# EAGLE design BiPAP_PCB_V2_Released (EAGLE 9.6.2)
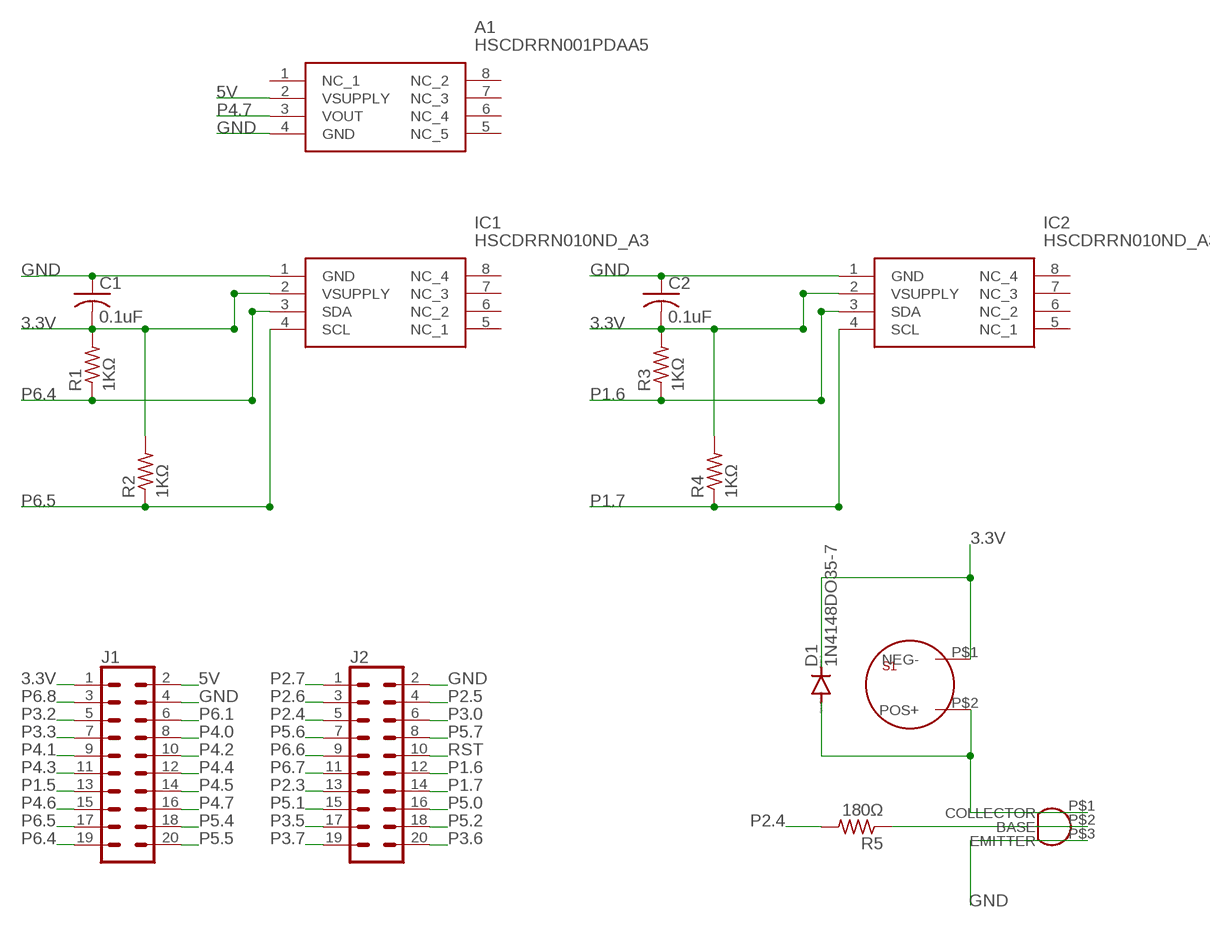
[diagram p0: schematic, sheet 1]

## Parts
A1  HSCDRRN001PDAA5  [HSCDRRN001PDAA5]
C1  0.1uF  C-USC0805  [C0805]
C2  0.1uF  C-USC0805  [C0805]
D1  1N4148DO35-7  [DO35-7]
IC1  HSCDRRN010ND_A3  HSCDRRN010ND2A3  [HSCDRRN010ND2A3]
IC2  HSCDRRN010ND_A3  HSCDRRN010ND2A3  [HSCDRRN010ND2A3]
J1  CONN_10X2  [2X10]
J2  CONN_10X2  [2X10]
R1  1KΩ  R-US_R0805  [R0805]
R2  1KΩ  R-US_R0805  [R0805]
R3  1KΩ  R-US_R0805  [R0805]
R4  1KΩ  R-US_R0805  [R0805]
R5  180Ω  R-US_R0805  [R0805]
S1  CEET120B085  [CEET120B085]
T1  BC337  [BC337]

## Nets
3.3V [Power]: C1.2 C2.2 D1.C IC1.2(VSUPPLY) IC2.2(VSUPPLY) J1.1 R1.2 R2.2 R3.2 R4.2 S1.P$1(NEG-)
5V [Power]: A1.2(VSUPPLY) J1.2
GND [Power]: A1.4(GND) C1.1 C2.1 IC1.1(GND) IC2.1(GND) J1.4 J2.2 T1.P$3(EMITTER)
N$2: D1.A S1.P$2(POS+) T1.P$1(COLLECTOR)
N$3: R5.1 T1.P$2(BASE)
P1.5: J1.13
P1.6: IC2.3(SDA) J2.12 R3.1
P1.7: IC2.4(SCL) J2.14 R4.1
P2.3: J2.13
P2.4: J2.5 R5.2
P2.5: J2.4
P2.6: J2.3
P2.7: J2.1
P3.0: J2.6
P3.2: J1.5
P3.3: J1.7
P3.5: J2.17
P3.6: J2.20
P3.7: J2.19
P4.0: J1.8
P4.1: J1.9
P4.2: J1.10
P4.3: J1.11
P4.4: J1.12
P4.5: J1.14
P4.6: J1.15
P4.7: A1.3(VOUT) J1.16
P5.0: J2.16
P5.1: J2.15
P5.2: J2.18
P5.4: J1.18
P5.5: J1.20
P5.6: J2.7
P5.7: J2.8
P6.1: J1.6
P6.4: IC1.3(SDA) J1.19 R1.1
P6.5: IC1.4(SCL) J1.17 R2.1
P6.6: J2.9
P6.7: J2.11
P6.8: J1.3
RST: J2.10
Unconnected: A1.1(NC_1) A1.5(NC_5) A1.6(NC_4) A1.7(NC_3) A1.8(NC_2) IC1.5(NC_1) IC1.6(NC_2) IC1.7(NC_3) IC1.8(NC_4) IC2.5(NC_1) IC2.6(NC_2) IC2.7(NC_3) IC2.8(NC_4)

## Library data of the parts
A1 = honeywell_sensors:HSCDRRN001PDAA5: Pressure Sensor -1 psi to 1 psi Differential Medical 8-Pin DIP Module Source: Datasheet <https://www.mouser.com/ProductDetail/Honeywell/HSCDRRN001PDAA5?qs=r31gx5qWCCu%2FOWBVVx989A%3D%3D>
C1 C2 = adafruit:C-US: CAPACITOR, American symbol
D1 = diode:1N4148: DIODE high speed (Philips)
IC1 IC2 = honeywell_sensors:HSCDRRN010ND2A3: Pressure Sensor -10inH2O to 10inH2O Differential Medical 8-Pin DIP Module Source: Datasheet <https://componentsearchengine.com/Datasheets/1/HSCDRRN010ND2A3.pdf>; DESCRIPTION: Pressure Sensor -10inH2O to 10inH2O Differential Medical 8-Pin DIP Module; HEIGHT: 6.16mm; MANUFACTURER_NAME: Honeywell; MANUFACTURER_PART_NUMBER: HSCDRRN010ND2A3; MOUSER_PART_NUMBER: 785-HSCDRRN010ND2A3; MOUSER_PRICE-STOCK: https://www.mouser.com/Search/Refine.aspx?Keyword=785-HSCDRRN010ND2A3
J1 J2 = SparkFun-Connectors:CONN_10X2: Multi connection point. Often used as Generic Header-pin footprint for 0.1 inch spaced/style header connections On any of the 0.1 inch spaced packages, you can populate with these: Break Away Headers - Straight <https://www.sparkfun.com/products/116> (PRT-00116) Break Away Male Headers - Right Angle <https://www.sparkfun.com/products/553> (PRT-00553) Female Headers <https://www.sparkfun.com/products/115> (PRT-00115) Break Away Headers - Machine Pin <https://www.sparkfun.com/products/117> (PRT-00117) Break Away Female Headers - Swiss Machine Pin <https://www.sparkfun.com/products/743> (PRT-00743) Special note about the "SPECIAL" package: This was SPECIALLY designed to be used with our Graphic LCD Backpack. Be sure you want to use this! It is not only staggered on each line of header holes, but IT IS ALSO offset of the center point of the top and bottom lines by 5 mil. This causes the headers to lock into place on the "standard" footprint on the LCD screen. The extra squares on the tdocu layer are there simply to reference other pins (if you were to actually populate a longer header than ten long - this is what we do with the backpacks).
R1-R5 = adafruit:R-US_: RESISTOR, American symbol
S1 = CEE120B085:CEET120B085
T1 = BC337:BC337

## Net classes
0 default: width 0.305 mm, clearance 0.305 mm
1 Power: width 0.508 mm, clearance 0.305 mm

## Board
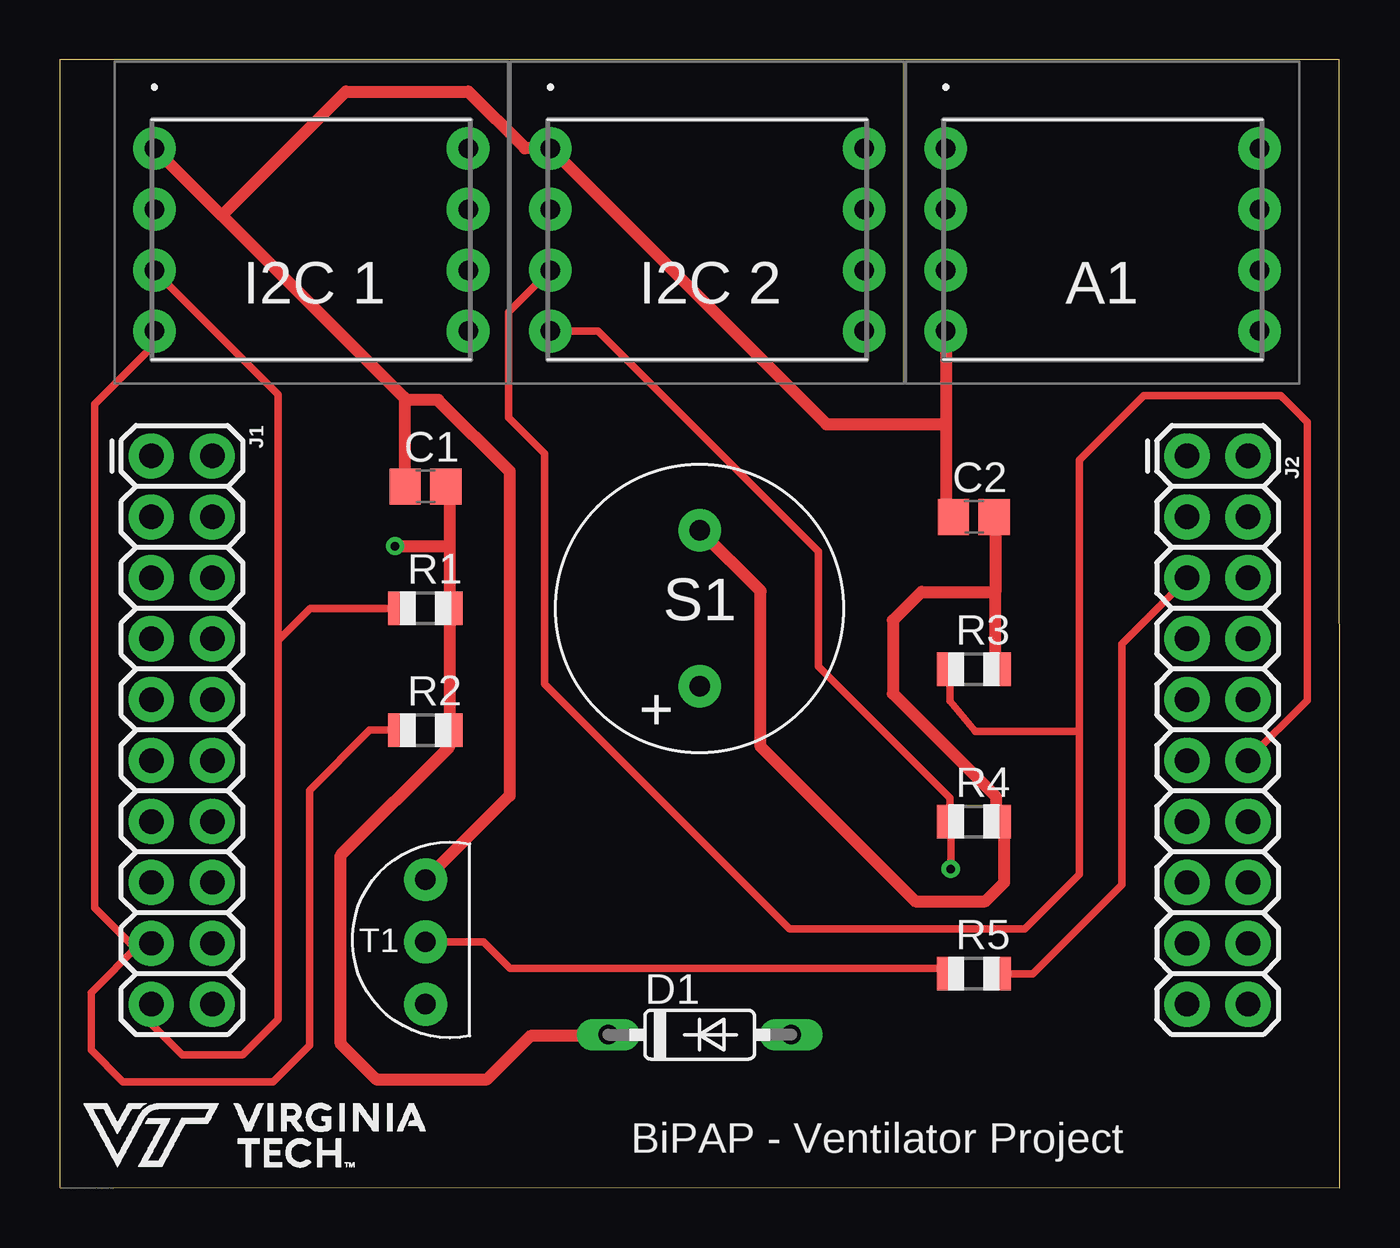
[diagram p1: board, top side]
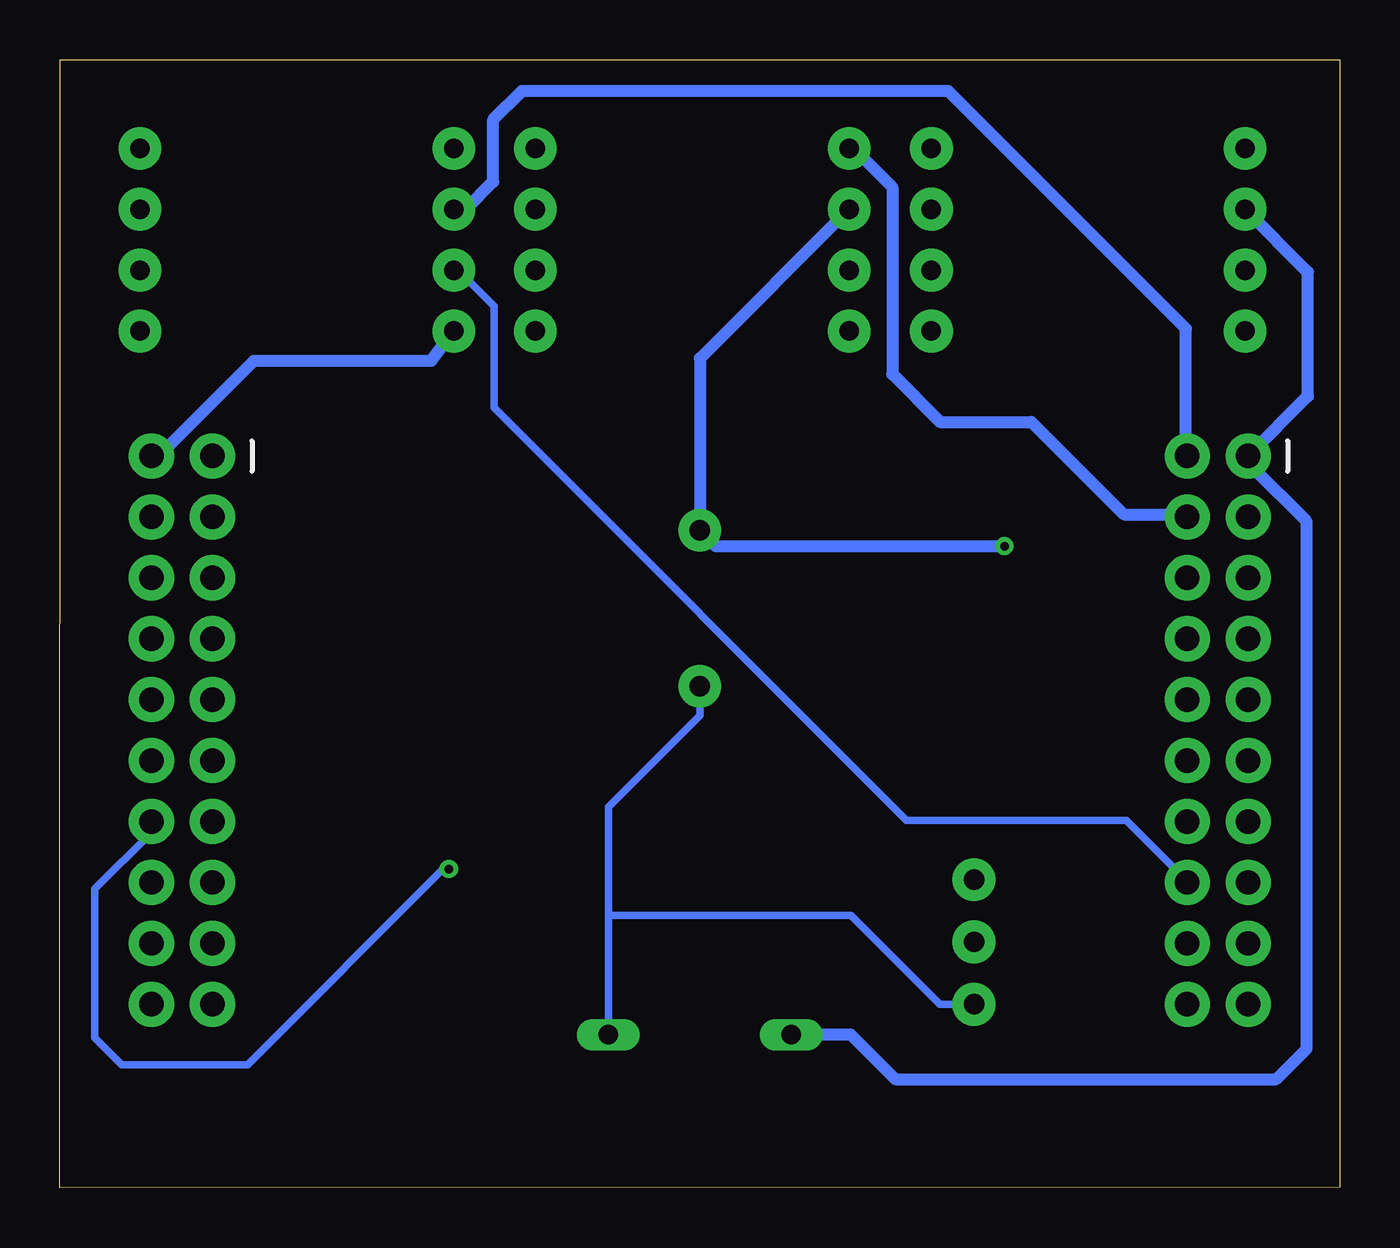
[diagram p2: board, bottom side, seen from below]

Size 53.35 x 47.02 mm. Coordinates in mm from the lower left corner, seen from the top.
Outline: 0,0.03 53.34,0 53.34,47.02 0,47.02 0,0.03
Copper layers (1*16): Top 0.035mm / dielectric 1.5mm / Bottom 0.035mm
Design rules "default": minimum track width 6mil, minimum drill 0.35mm, track to track 6mil, track to pad 6mil, pad to pad 6mil, via to via 6mil, smd to smd 6mil, copper to edge 40mil, drill to drill 6mil, minimum pad ring 10mil, minimum via ring 8mil, stop-mask expansion 4mil, vias tented up to drill 0mil, thermal gap 10mil

### Footprints (pad centres in the part's own frame; a part is rotated, then mirrored left to right if it is on the bottom)
HSCDRRN001PDAA5 = drill 0.813 pad 1.778: 1 0,0; 2 2.54,0; 3 5.08,0; 4 7.62,0; 5 7.62,13.08; 6 5.08,13.08; 7 2.54,13.08; 8 0,13.08
C0805 = smd 1.3 x 1.5: 1 -0.85,0; 2 0.85,0
DO35-7 = drill 0.813 long: A 3.81,0; C -3.81,0
HSCDRRN010ND2A3 = drill 0.813 pad 1.778: 1 0,0; 2 2.54,0; 3 5.08,0; 4 7.62,0; 5 7.62,13.08; 6 5.08,13.08; 7 2.54,13.08; 8 0,13.08
2X10 = drill 1.016 pad 1.88: 1 0,0; 2 0,2.54; 3 2.54,0; 4 2.54,2.54; 5 5.08,0; 6 5.08,2.54; 7 7.62,0; 8 7.62,2.54; 9 10.16,0; 10 10.16,2.54; 11 12.7,0; 12 12.7,2.54; 13 15.24,0; 14 15.24,2.54; 15 17.78,0; 16 17.78,2.54; 17 20.32,0; 18 20.32,2.54; 19 22.86,0; 20 22.86,2.54
R0805 = smd 1.1 x 1.4: 1 -1,0; 2 1,0
CEET120B085 = drill 0.85 pad 1.778: P$1 0,3.25; P$2 0,-3.25
BC337 = drill 0.85 pad 1.778: P$1 0,0; P$2 2.6,0; P$3 5.2,0

### Placement (x,y rotation side)
A1  36.93,43.33 270 top
C1  15.24,29.24 0 top
C2  38.1,27.97 0 top
D1  26.67,6.38 0 top
IC1  3.94,43.33 270 top
IC2  20.45,43.33 270 top
J1  3.81,30.51 270 top
J2  46.99,30.51 270 top
R1  15.24,24.16 0 top
R2  15.24,19.08 0 top
R3  38.1,21.62 0 top
R4  38.1,15.27 0 top
R5  38.1,8.92 0 top
S1  26.67,24.16 0 top
T1  15.24,7.65 90 top

### Tracks (layer width: path | path; a pad name or v marks a point on that pad's centre or on a via)
3.3V  (via drill 0.35)
  Top 0.508: R3.2 39.17,21.67 38.99,21.84 38.99,24.84 | C2.2 38.99,27.93 38.99,24.84 | R1.2 R2.2 16.24,18.4 11.71,13.87 11.71,5.99 13.21,4.5 17.78,4.5 19.61,6.32 22.81,6.32 D1.C | C1.2 16.24,29.24 R1.2 | v13.97,26.75 16.24,26.75 R1.2 | 38.99,24.84 35.92,24.84 34.72,23.65 34.72,20.6 39.01,16.31 39.01,15.27 R4.2 39.37,15 39.37,12.73 38.58,11.94 35.66,11.94 29.21,18.39 29.21,24.87 S1.P$1
  Bottom 0.508: IC1.2 1.32,38.18 1.32,32.99 J1.1 3.66,30.35 3.66,30.05 1.37,27.76 1.37,5.79 2.64,4.52 18.52,4.52 20.37,6.38 D1.C | v13.97,26.75 26.01,26.75 S1.P$1 26.67,34.57 IC2.2
5V
  Bottom 0.508: J1.2 6.4,30.51 6.4,35.81 16.31,45.72 34.09,45.72 35.28,44.53 35.28,41.94 36.42,40.79 A1.2
GND
  Top 0.508: A1.4 36.93,31.7 | 6.78,40.56 11.91,45.69 17.02,45.69 19.38,43.33 IC2.1 31.95,31.83 36.8,31.83 36.93,31.7 | 14.38,32.84 15.77,32.84 18.75,29.87 18.75,16.35 T1.P$3 | 36.93,31.7 36.93,28.28 C2.1 | 6.78,40.56 6.78,40.51 14.38,32.92 14.38,32.84 | 6.78,40.56 6.71,40.56 IC1.1 | 14.38,32.84 14.38,29.25 C1.1
  Bottom 0.508: J2.2 49.23,30.51 45.26,34.47 37.87,34.47 A1.4 | IC2.1 20.27,43.33 18.64,41.71 18.64,33.91 16.66,31.93 12.85,31.93 8.99,28.07 6.4,28.07 J1.4
N$2
  Bottom 0.305: 30.48,11.35 30.48,15.88 26.67,19.69 S1.P$2 | 30.48,11.35 D1.A | 30.48,11.35 20.37,11.35 16.66,7.65 T1.P$1
N$3
  Top 0.305: T1.P$2 17.65,10.25 18.75,9.14 36.95,9.14 R5.1
P1.6
  Top 0.305: R3.1 37.1,20.29 38.17,19.02 42.49,19.02 | J2.12 49.53,17.86 51.99,20.32 51.99,31.93 50.9,33.02 45.19,33.02 42.49,30.33 42.49,19.02 | IC2.3 18.69,36.5 18.69,32.11 20.19,30.61 20.19,21.01 30.4,10.8 40.23,10.8 42.49,13.06 42.49,19.02
P1.7  (via drill 0.35)
  Top 0.305: IC2.4 22.43,35.71 31.62,26.52 31.62,21.73 37.1,16.26 R4.1 37.13,15.27 v37.13,13.28
  Bottom 0.305: J2.14 49.53,14.81 51.89,12.45 51.89,6.25 50.77,5.13 45.52,5.13 37.36,13.28 v37.13,13.28
P2.4
  Top 0.305: R5.2 40.56,8.92 44.27,12.62 44.27,22.66 46.94,25.32 J2.5
P4.7
  Bottom 0.305: A1.3 36.75,38.25 35.26,36.75 35.26,32.51 18.06,15.32 8.89,15.32 6.4,12.83 J1.16
P6.4
  Top 0.305: 9.09,22.82 9.09,33.07 3.94,38.23 IC1.3 | R1.1 10.43,24.16 9.09,22.82 | J1.19 3.81,6.83 5.11,5.54 7.62,5.54 9.09,7.01 9.09,22.82
P6.5
  Top 0.305: R2.1 12.92,19.08 10.41,16.57 10.41,5.94 8.89,4.42 2.62,4.42 1.29,5.74 1.29,8.13 3.35,10.19 J1.17 2.92,10.19 1.45,11.66 1.45,32.66 3.94,35.15 IC1.4

### Text on the board
tPlace: BiPAP - Ventilator Project | C:/Users/Candy/Downloads/HorizontalStacked_CMYK_black-01.bmp
tNames: I2C 1 | I2C 2 | A1 | +